# EAGLE design TuringMixExpanderNoLogo (EAGLE 7.2.0)
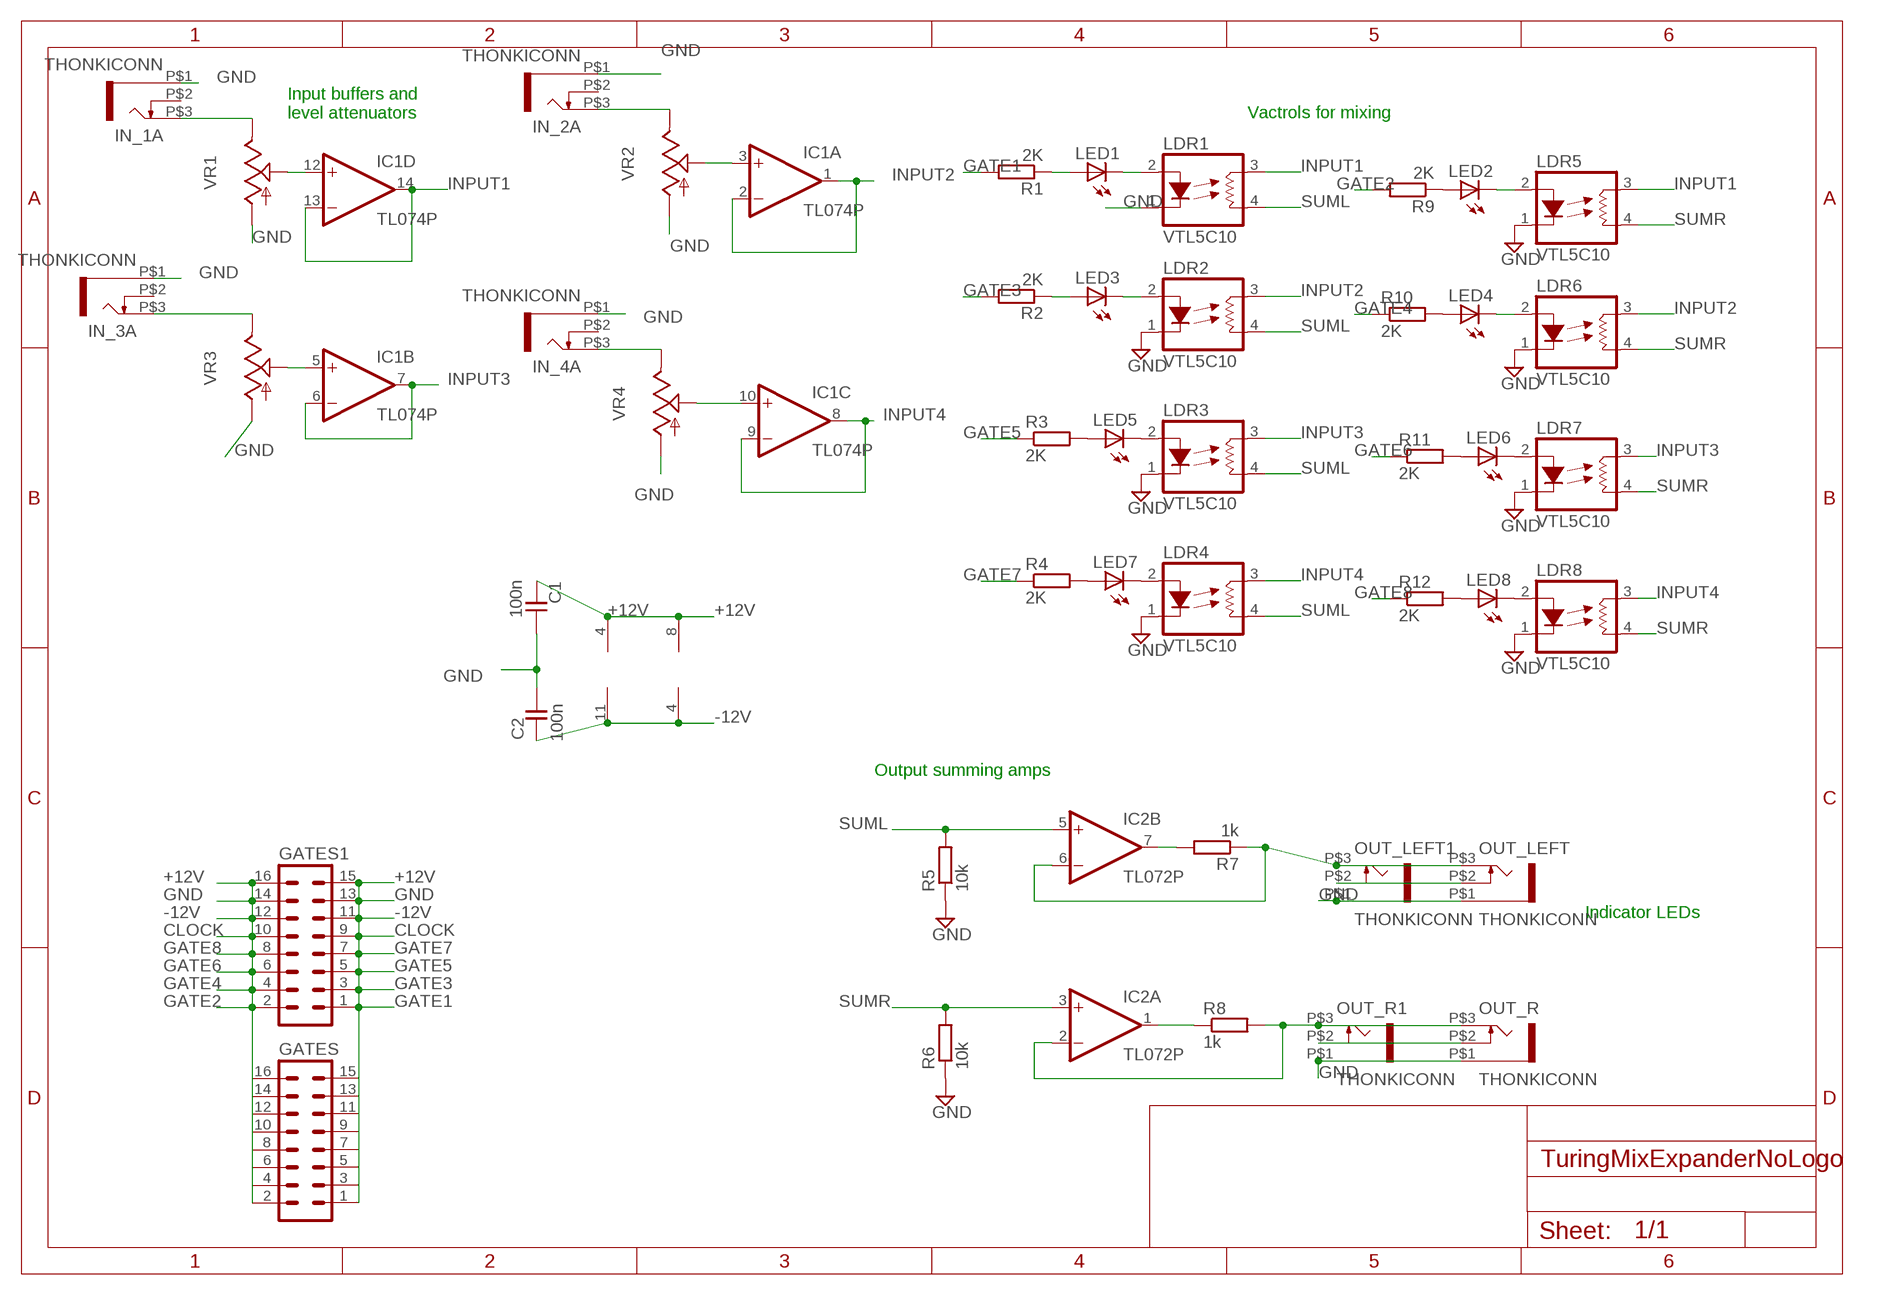
[diagram p0: schematic, sheet 1]

## Parts
C1  100n  C-EU050-024X044  [C050-024X044]
C2  100n  C-EU050-024X044  [C050-024X044]
GATES  MA08-2  [MA08-2]
GATES1  MA08-2  [MA08-2]
IC1  TL074P  [DIL14]
IC2  TL072P  [DIL08]
IN_1A  THONKICONN  [THONKICONN]
IN_2A  THONKICONN  [THONKICONN]
IN_3A  THONKICONN  [THONKICONN]
IN_4A  THONKICONN  [THONKICONN]
LDR1  VTL5C10  [VTL5C]
LDR2  VTL5C10  [VTL5C]
LDR3  VTL5C10  [VTL5C]
LDR4  VTL5C10  [VTL5C]
LDR5  VTL5C10  [VTL5C]
LDR6  VTL5C10  [VTL5C]
LDR7  VTL5C10  [VTL5C]
LDR8  VTL5C10  [VTL5C]
LED1  LED3MM  [LED3MM]
LED2  LED3MM  [LED3MM]
LED3  LED3MM  [LED3MM]
LED4  LED3MM  [LED3MM]
LED5  LED3MM  [LED3MM]
LED6  LED3MM  [LED3MM]
LED7  LED3MM  [LED3MM]
LED8  LED3MM  [LED3MM]
OUT_LEFT  THONKICONN  [THONKICONN]
OUT_LEFT1  THONKICONN  [THONKICONN]
OUT_R  THONKICONN  [THONKICONN]
OUT_R1  THONKICONN  [THONKICONN]
R1  2K  R-EU_0207/7  [0207/7]
R2  2K  R-EU_0207/7  [0207/7]
R3  2K  R-EU_0207/7  [0207/7]
R4  2K  R-EU_0207/7  [0207/7]
R5  10k  R-EU_0207/7  [0207/7]
R6  10k  R-EU_0207/7  [0207/7]
R7  1k  R-EU_0207/7  [0207/7]
R8  1k  R-EU_0207/7  [0207/7]
R9  2K  R-EU_0207/7  [0207/7]
R10  2K  R-EU_0207/7  [0207/7]
R11  2K  R-EU_0207/7  [0207/7]
R12  2K  R-EU_0207/7  [0207/7]
VR1  ALPHA-9MMF2A  [EVUF]
VR2  ALPHA-9MMF2A  [EVUF]
VR3  ALPHA-9MMF2A  [EVUF]
VR4  ALPHA-9MMF2A  [EVUF]

## Nets
+12V [power]: C1.2 GATES1.15 GATES1.16 GATES.15 GATES.16 IC1.4(P:V+) IC2.8(P:V+)
-12V [power]: C2.2 GATES1.11 GATES1.12 GATES.11 GATES.12 IC1.11(P:V-) IC2.4(P:V-)
CLOCK: GATES1.9 GATES1.10 GATES.9 GATES.10
GATE1: GATES1.1 GATES.1 R1.2
GATE2: GATES1.2 GATES.2 R9.2
GATE3: GATES1.3 GATES.3 R2.2
GATE4: GATES1.4 GATES.4 R10.1
GATE5: GATES1.5 GATES.5 R3.1
GATE6: GATES1.6 GATES.6 R11.1
GATE7: GATES1.7 GATES.7 R4.1
GATE8: GATES1.8 GATES.8 R12.1
GND [ground]: C1.1 C2.1 GATES1.13 GATES1.14 GATES.13 GATES.14 IN_1A.P$1 IN_2A.P$1 IN_3A.P$1 IN_4A.P$1 LDR1.1(LED-) LDR2.1(LED-) LDR3.1(LED-) LDR4.1(LED-) LDR5.1(LED-) LDR6.1(LED-) LDR7.1(LED-) LDR8.1(LED-) OUT_LEFT1.P$1 OUT_LEFT.P$1 OUT_R1.P$1 OUT_R.P$1 R5.1 R6.1 VR1.1(A) VR2.1(A) VR3.1(A) VR4.1(A)
INPUT1: IC1.13(D:-IN) IC1.14(D:OUT) LDR1.3(RES1) LDR5.3(RES1)
INPUT2: IC1.1(A:OUT) IC1.2(A:-IN) LDR2.3(RES1) LDR6.3(RES1)
INPUT3: IC1.6(B:-IN) IC1.7(B:OUT) LDR3.3(RES1) LDR7.3(RES1)
INPUT4: IC1.8(C:OUT) IC1.9(C:-IN) LDR4.3(RES1) LDR8.3(RES1)
N$1: IN_1A.P$3 VR1.3(E)
N$2: IC1.12(D:+IN) VR1.2(S)
N$3: IN_2A.P$3 VR2.3(E)
N$4: IC1.3(A:+IN) VR2.2(S)
N$5: IC2.7(B:OUT) R7.2
N$6: IC2.1(A:OUT) R8.1
N$7: IC2.6(B:-IN) OUT_LEFT1.P$3 OUT_LEFT.P$3 R7.1
N$10: IC2.2(A:-IN) OUT_R1.P$3 OUT_R.P$3 R8.2
N$11: IC1.5(B:+IN) VR3.2(S)
N$12: IN_3A.P$3 VR3.3(E)
N$13: IN_4A.P$3 VR4.3(E)
N$14: LDR1.2(LED+) LED1.K(C)
N$15: LDR2.2(LED+) LED3.K(C)
N$16: LDR3.2(LED+) LED5.K(C)
N$17: LDR4.2(LED+) LED7.K(C)
N$18: LDR5.2(LED+) LED2.K(C)
N$19: LDR6.2(LED+) LED4.K(C)
N$20: LDR7.2(LED+) LED6.K(C)
N$21: LDR8.2(LED+) LED8.K(C)
N$22: OUT_LEFT1.P$2 OUT_LEFT.P$2
N$23: IC1.10(C:+IN) VR4.2(S)
N$24: OUT_R1.P$2 OUT_R.P$2
N$25: LED1.A R1.1
N$26: LED3.A R2.1
N$27: LED5.A R3.2
N$28: LED7.A R4.2
N$29: LED2.A R9.1
N$30: LED4.A R10.2
N$31: LED6.A R11.2
N$32: LED8.A R12.2
SUML: IC2.5(B:+IN) LDR1.4(RES2) LDR2.4(RES2) LDR3.4(RES2) LDR4.4(RES2) R5.2
SUMR: IC2.3(A:+IN) LDR5.4(RES2) LDR6.4(RES2) LDR7.4(RES2) LDR8.4(RES2) R6.2
Unconnected: IN_1A.P$2 IN_2A.P$2 IN_3A.P$2 IN_4A.P$2

## Notes on the sheet
- Input buffers and 
  level attenuators
- Vactrols for mixing
- Output summing amps
- Indicator LEDs

## Library data of the parts
C1 C2 = TomW:C-EU: CAPACITOR, European symbol
GATES GATES1 = con-lstb:MA08-2: PIN HEADER; OC_FARNELL: unknown; OC_NEWARK: unknown
IC1 = linear:TL074: OP AMP
IC2 = TomW:TL072: OP AMP
IN_1A IN_2A IN_3A IN_4A OUT_LEFT OUT_LEFT1 OUT_R OUT_R1 = TomW:THONKICONN
LDR1-LDR8 = TomW:VTL5C*: Low Cost Axial Vactrols Source: www.perkinelmer.com/opto ... vtl5c9_c10.pdf
LED1-LED8 = TomW:LED: LED OSRAM: - CHIPLED LG R971, LG N971, LY N971, LG Q971, LY Q971, LO R971, LY R971 LH N974, LH R974 LS Q976, LO Q976, LY Q976 LO Q996 - Hyper CHIPLED LW Q18S LB Q993, LB Q99A, LB R99A - SideLED LS A670, LO A670, LY A670, LG A670, LP A670 LB A673, LV A673, LT A673, LW A673 LH A674 LY A675 LS A676, LA A676, LO A676, LY A676, LW A676 LS A679, LY A679, LG A679 - Hyper Micro SIDELED® LS Y876, LA Y876, LO Y876, LY Y876 LT Y87S - SmartLED LW L88C, LW L88S LB L89C, LB L89S, LG L890 LS L89K, LO L89K, LY L89K LS L896, LA L896, LO L896, LY L896 - TOPLED LS T670, LO T670, LY T670, LG T670, LP T670 LSG T670, LSP T670, LSY T670, LOP T670, LYG T670 LG T671, LOG T671, LSG T671 LB T673, LV T673, LT T673, LW T673 LH T674 LS T676, LA T676, LO T676, LY T676, LB T676, LH T676, LSB T676, LW T676 LB T67C, LV T67C, LT T67C, LS T67K, LO T67K, LY T67K, LW E67C LS E67B, LA E67B, LO E67B, LY E67B, LB E67C, LV E67C, LT E67C LW T67C LS T679, LY T679, LG T679 LS T770, LO T770, LY T770, LG T770, LP T770 LB T773, LV T773, LT T773, LW T773 LH T774 LS E675, LA E675, LY E675, LS T675 LS T776, LA T776, LO T776, LY T776, LB T776 LHGB T686 LT T68C, LB T68C - Hyper Mini TOPLED® LB M676 - Mini TOPLED Santana® LG M470 LS M47K, LO M47K, LY M47K Source: http://www.osram.convergy.de LUXEON: - LUMILED® LXK2-PW12-R00, LXK2-PW12-S00, LXK2-PW14-U00, LXK2-PW14-V00 LXK2-PM12-R00, LXK2-PM12-S00, LXK2-PM14-U00 LXK2-PE12-Q00, LXK2-PE12-R00, LXK2-PE12-S00, LXK2-PE14-T00, LXK2-PE14-U00 LXK2-PB12-K00, LXK2-PB12-L00, LXK2-PB12-M00, LXK2-PB14-N00, LXK2-PB14-P00, LXK2-PB14-Q00 LXK2-PR12-L00, LXK2-PR12-M00, LXK2-PR14-Q00, LXK2-PR14-R00 LXK2-PD12-Q00, LXK2-PD12-R00, LXK2-PD12-S00 LXK2-PH12-R00, LXK2-PH12-S00 LXK2-PL12-P00, LXK2-PL12-Q00, LXK2-PL12-R00 Source: www.luxeon.com KINGBRIGHT: KA-3528ASYC Source: www.kingbright.com
R1-R12 = TomW:R-EU_: RESISTOR, European symbol
VR1-VR4 = TomW:ALPHA-9MM: 9 mm Square Rotary Potentiometers Source: Panasonic

## Net classes
0 default: width 0.254 mm
1 power: width 0.406 mm
2 ground: width 0.406 mm

## Board
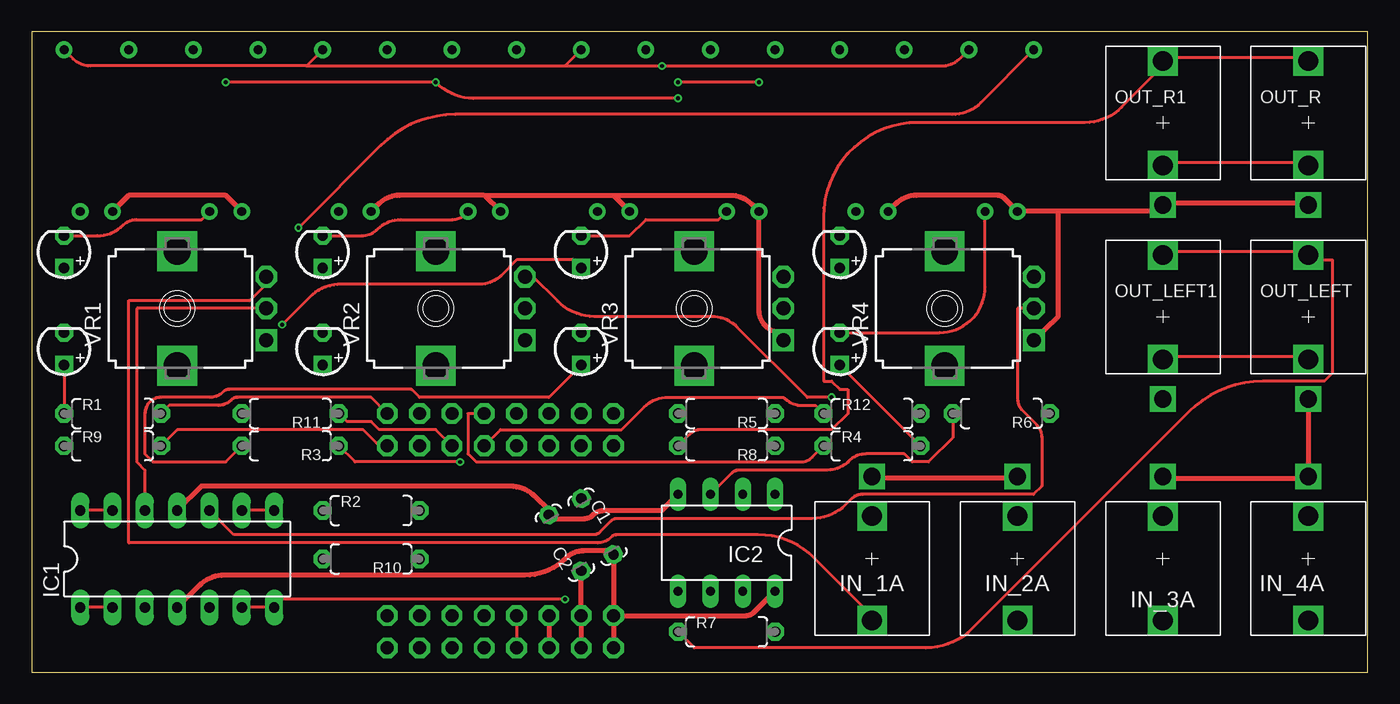
[diagram p1: board, top side]
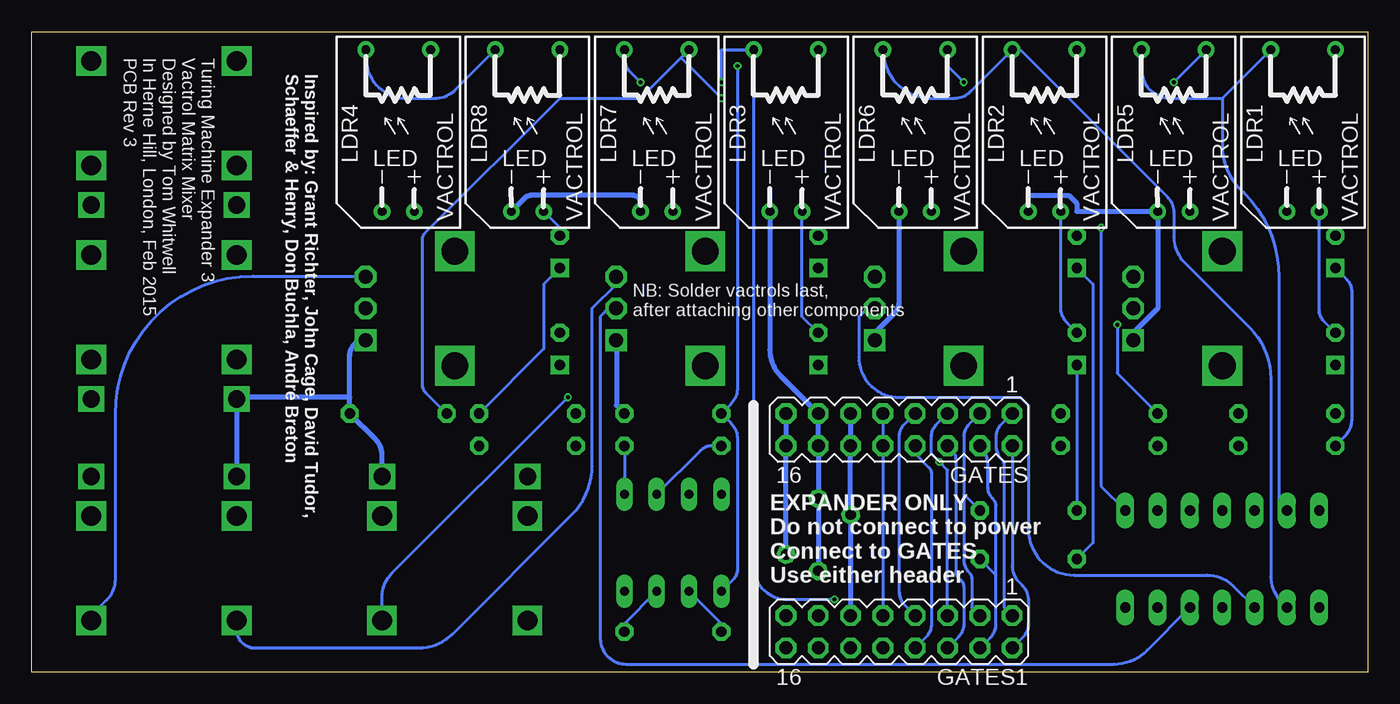
[diagram p2: board, bottom side, seen from below]

Size 105 x 50.31 mm. Coordinates in mm from the lower left corner, seen from the top.
Outline: 0,50.31 0,0 105,0 105,50.31 0,50.31
Copper layers (1*2*15*16): Top 0.035mm / dielectric 0.2mm / Route2 0.0175mm / dielectric 1.1mm / Route15 0.0175mm / dielectric 0.2mm / Bottom 0.035mm
Design rules "MT Design Rules": minimum track width 6mil, minimum drill 12mil, track to track 10mil, track to pad 10mil, pad to pad 6mil, via to via 6mil, smd to smd 0mil, copper to edge 10mil, drill to drill 10mil, minimum pad ring 12mil, minimum via ring 6mil, stop-mask expansion 2mil, vias tented up to drill 25mil, thermal gap 10mil

### Footprints (pad centres in the part's own frame; a part is rotated, then mirrored left to right if it is on the bottom)
C050-024X044 = drill 0.813 octagon: 1 -2.54,0; 2 2.54,0
MA08-2 = drill 1.016 octagon: 1 -8.89,-1.27; 2 -8.89,1.27; 3 -6.35,-1.27; 4 -6.35,1.27; 5 -3.81,-1.27; 6 -3.81,1.27; 7 -1.27,-1.27; 8 -1.27,1.27; 9 1.27,-1.27; 10 1.27,1.27; 11 3.81,-1.27; 12 3.81,1.27; 13 6.35,-1.27; 14 6.35,1.27; 15 8.89,-1.27; 16 8.89,1.27
DIL14 = drill 0.813 long: 1 -7.62,-3.81; 2 -5.08,-3.81; 3 -2.54,-3.81; 4 0,-3.81; 5 2.54,-3.81; 6 5.08,-3.81; 7 7.62,-3.81; 8 7.62,3.81; 9 5.08,3.81; 10 2.54,3.81; 11 0,3.81; 12 -2.54,3.81; 13 -5.08,3.81; 14 -7.62,3.81
DIL08 = drill 0.7 long: 1 -3.81,-3.81; 2 -1.27,-3.81; 3 1.27,-3.81; 4 3.81,-3.81; 5 3.81,3.81; 6 1.27,3.81; 7 -1.27,3.81; 8 -3.81,3.81
THONKICONN = drill 1.35 square: P$1 0,-6.48 | drill 1.55 square: P$2 0,-3.38; P$3 0,4.84
VTL5C = drill 0.7 pad 1.3: 1 -6.35,1.27; 2 -6.35,-1.27; 3 6.35,2.54; 4 6.35,-2.54
LED3MM = drill 0.813 square: A -1.27,0 | drill 0.813 octagon: K 1.27,0
0207/7 = drill 0.813 octagon: 1 -3.81,0; 2 3.81,0
EVUF = drill 1.1 pad 1.676 square: 1 -2.5,-7 | drill 1.1 pad 1.676 octagon: 2 0,-7; 3 2.5,-7 | drill 2.1 pad 2.8 square: M1 4.5,0; M2 -4.5,0

### Placement (x,y rotation side)
C1  44.45,11.43 300 top
C2  41.91,10.16 120 top
GATES  36.83,19.05 180 bottom
GATES1  36.83,3.17 180 bottom
IC1  11.43,8.89 0 top
IC2  54.61,10.16 180 top
IN_1A  66.04,8.89 180 top
IN_2A  77.47,8.89 180 top
IN_3A  88.9,8.89 180 top
IN_4A  100.33,8.89 180 top
LDR1  5.08,42.55 90 bottom
LDR2  25.4,42.55 90 bottom
LDR3  45.72,42.55 90 bottom
LDR4  76.2,42.55 90 bottom
LDR5  15.24,42.55 90 bottom
LDR6  35.56,42.55 90 bottom
LDR7  55.88,42.55 90 bottom
LDR8  66.04,42.55 90 bottom
LED1  2.54,25.4 90 top
LED2  2.54,33.02 90 top
LED3  22.86,25.4 90 top
LED4  22.86,33.02 90 top
LED5  43.18,25.4 90 top
LED6  43.18,33.02 90 top
LED7  63.5,25.4 90 top
LED8  63.5,33.02 90 top
OUT_LEFT  100.33,27.94 0 top
OUT_LEFT1  88.9,27.94 0 top
OUT_R  100.33,43.18 0 top
OUT_R1  88.9,43.18 0 top
R1  6.35,20.32 0 top
R2  26.67,12.7 0 top
R3  20.32,17.78 180 top
R4  66.04,17.78 0 top
R5  54.61,20.32 180 top
R6  76.2,20.32 180 top
R7  54.61,3.17 0 top
R8  54.61,17.78 180 top
R9  6.35,17.78 0 top
R10  26.67,8.89 180 top
R11  20.32,20.32 180 top
R12  66.04,20.32 0 top
VR1  11.43,28.57 90 top
VR2  31.75,28.57 90 top
VR3  52.07,28.57 90 top
VR4  71.75,28.57 90 top

### Tracks (layer width: path | path; a pad name or v marks a point on that pad's centre or on a via)
+12V
  Top 0.406: GATES1.15 56.14,4.45 arc45 56.78,4.71 IC2.8 | GATES1.15 GATES1.16 | IC1.4 13.14,6.79 arc-45 15.15,7.62 38.74,7.62 arc45 41.98,8.96 arc-45 43.34,9.53 45.72,9.53 C1.2 GATES1.15
  Bottom 0.406: GATES.15 GATES.16 C1.2
-12V
  Top 0.406: GATES1.11 GATES1.12 | IC2.4 49.53,12.7 44.98,12.7 arc45 44.08,12.33 arc-45 43.44,12.06 40.64,12.06 C2.2 40.64,12.7 39.52,13.82 arc45 37.62,14.61 13.34,14.61 IC1.11
  Bottom 0.406: GATES.11 GATES.12 C2.2 GATES1.11
CLOCK
  Top 0.254: GATES1.9 GATES1.10
  Bottom 0.254: GATES.9 GATES.10 GATES1.9
GATE1
  Top 0.254: R1.2 10.79,20.95 14.65,20.95 arc45 15.66,21.37 arc-45 16.18,21.59 26.67,21.59 GATES.1
  Bottom 0.254: GATES1.1 28.57,5.08 28.57,16.25 arc-45 28.76,16.7 28.79,16.73 arc45 29.21,17.73 29.21,18.52 arc45 28.84,19.42 GATES.1
GATE2
  Top 0.254: R9.2 11.43,19.05 26.04,19.05 27.3,17.78 GATES.2
  Bottom 0.254: GATES1.2 27.09,2.76 arc-45 26.67,3.76 26.67,5.61 arc-45 27.2,6.88 27.41,7.09 arc45 27.94,8.36 GATES.2
GATE3
  Bottom 0.254: 31.75,13.97 R2.2 | GATES.3 31.38,19.42 arc-45 31.75,18.52 31.75,13.97 | GATES1.3 31.11,5.08 31.11,7.36 arc-45 31.3,7.81 31.33,7.84 arc45 31.75,8.84 31.75,13.97
GATE4
  Bottom 0.254: 29.21,7.62 R10.1 | GATES1.4 29.63,2.76 arc-45 29.21,3.76 29.21,7.62 | 29.21,7.62 29.21,13.07 arc-45 29.4,13.52 29.43,13.55 arc45 29.84,14.56 29.84,16.31 arc-45 30.43,17.73 GATES.4
GATE5  (via drill 0.3)
  Top 0.254: R3.1 25.4,16.51 v33.66,16.51
  Bottom 0.254: GATES1.5 33.02,15.88 v33.66,16.51 34.29,17.14 34.29,18.52 arc45 33.92,19.42 GATES.5
GATE6
  Top 0.254: R11.1 24.77,19.68 26.67,19.68 27.3,19.05 31.75,19.05 GATES.6
  Bottom 0.254: GATES1.6 32.17,2.76 arc-45 31.75,3.76 31.75,6.72 arc-45 31.94,7.17 32.2,7.43 arc45 32.38,7.88 32.38,16.77 arc-45 32.65,17.41 GATES.6
GATE7
  Top 0.254: R4.1 61.33,16.88 arc-45 60.43,16.51 34.92,16.51 34.29,17.14 34.29,20.32 GATES.7
  Bottom 0.254: GATES.7 36.46,19.42 arc-45 36.83,18.52 36.83,6.3 arc-45 36.41,5.3 GATES1.7
GATE8
  Top 0.254: R12.1 61.59,20.95 60.59,20.95 arc-45 59.05,21.59 49.98,21.59 arc45 48.13,20.82 46.35,19.05 36.83,19.05 GATES.8
  Bottom 0.254: GATES1.8 34.71,2.76 arc-45 34.29,3.76 34.29,15.61 arc-45 34.48,16.06 35.56,17.14 GATES.8
GND
  Top 0.406: LDR8.1 67.91,36.79 arc-45 69.53,37.47 75.94,37.47 arc-45 76.39,37.28 LDR4.1 80.64,36.2 | OUT_R.P$1 100.33,36.83 88.9,36.83 OUT_R1.P$1 88.9,36.2 80.64,36.2 | OUT_LEFT.P$1 IN_4A.P$1 100.33,15.24 88.9,15.24 IN_3A.P$1 | IN_1A.P$1 66.04,15.24 77.47,15.24 IN_2A.P$1 | 80.64,36.2 80.64,27.89 VR4.1 | LDR1.1 7.62,37.47 15.24,37.47 LDR5.1 | C2.1 GATES1.13 GATES1.14 | VR3.1 59.05,26.67 58.95,26.67 arc-90 57.15,28.47 LDR7.1 56.55,36.79 arc45 54.93,37.47 45.72,37.47 | 35.56,37.47 28.89,37.47 arc45 27.27,36.79 LDR2.1 | LDR6.1 35.56,37.47 | 45.72,37.47 LDR3.1 | 35.56,37.47 45.72,37.47
  Bottom 0.406: IN_3A.P$1 OUT_LEFT1.P$1 88.9,21.59 80.01,21.59 | IN_2A.P$1 77.47,17.04 arc-45 78,18.31 R6.1 80.01,21.59 | 80.01,21.59 80.01,24.87 arc45 79.64,25.77 79.38,26.04 VR4.1 | VR1.1 18.41,26.67 16.51,28.57 LDR5.1 22.86,36.2 22.86,36.83 23.5,37.47 26.67,37.47 LDR2.1 | C2.1 C1.1 GATES.14 GATES.13 46.16,23.3 arc45 46.99,25.31 LDR3.1 | R5.1 59.05,20.95 59.05,26.04 VR3.1 | LDR6.1 36.83,29.16 arc45 37.25,28.16 38.73,26.67 VR2.1 | LDR7.1 57.15,36.83 arc-90 57.78,37.47 65.78,37.47 arc-45 66.23,37.28 LDR8.1
INPUT1
  Top 0.254: IC1.13 IC1.14
  Bottom 0.254: 11.43,45.09 LDR1.3 | LDR5.3 17.78,47.38 arc-90 15.49,45.09 11.43,45.09 | IC1.13 6.99,13.34 6.99,31.04 arc-45 9.73,37.67 10.09,38.03 arc45 11.43,41.27 11.43,45.09
INPUT2
  Top 0.254: IC1.2 IC1.1
  Bottom 0.254: LDR6.3 arc-90 34.29,45.09 32.54,45.09 arc-45 31.19,45.64 LDR2.3 27.3,48.9 15.77,37.36 arc45 15.24,36.09 15.24,34.2 arc-45 14.41,32.19 9.28,27.06 arc45 7.62,23.05 7.62,7.53 arc-45 6.79,5.52 IC1.2
INPUT3  (via drill 0.3)
  Top 0.254: IC1.6 IC1.7 19.68,5.71 v41.91,5.71 | v57.15,46.35 v50.8,46.35
  Bottom 0.254: v50.8,46.35 50.8,48.9 LDR3.3 48.26,8.33 arc-90 45.64,5.71 v41.91,5.71 | LDR7.3 58.42,48.21 arc-45 58,47.21 v57.15,46.35
INPUT4  (via drill 0.3)
  Top 0.254: IC1.8 IC1.9 | LDR4.3 74.59,44.74 arc-45 72.34,43.81 33.27,43.81 arc45 27.42,41.39 v20.95,34.92
  Bottom 0.254: LDR4.3 78.74,48.26 arc-90 75.56,45.09 73.34,45.09 arc-45 71.72,45.76 LDR8.3 | IC1.8 20.95,14.61 v20.95,34.92
N$1
  Top 0.254: VR1.3 18.41,30.48 17.14,29.21 7.62,29.21 7.62,10.16 44.5,10.16 arc45 45.5,10.58 45.53,10.61 arc-45 45.98,10.79 57.1,10.79 arc-45 61.52,8.96 66.04,4.45 IN_1A.P$3
N$2
  Top 0.254: IC1.12 8.89,15.88 8.26,16.51 8.26,28.57 VR1.2
N$3  (via drill 0.3)
  Top 0.254: v62.87,21.59 60.96,21.59 55.44,27.11 arc45 53.43,27.94 44.23,27.94 arc-45 41.35,29.13 39.37,31.11 VR2.3
  Bottom 0.254: IN_2A.P$3 77.47,5.9 arc45 76.7,7.75 v62.87,21.59
N$4
  Bottom 0.254: IC1.3 10.6,6.79 arc-45 12.61,7.62 23.08,7.62 arc90 26.67,11.21 26.67,20.95 27.3,21.59 36.83,21.59 arc90 40.01,24.77 40.01,27.94 39.37,28.57 VR2.2
N$5
  Bottom 0.254: IC2.7 58.42,3.81 R7.2
N$6
  Bottom 0.254: R8.1 IC2.1
N$7
  Top 0.254: R7.1 52.07,1.91 70.27,1.91 arc45 73.89,3.4 90.93,20.44 arc-45 96.76,22.86 101.6,22.86 102.23,23.5 102.23,32.38 100.33,32.38 OUT_LEFT.P$3 100.33,33.02 88.9,33.02 OUT_LEFT1.P$3
  Bottom 0.254: IC2.6 50.8,3.81 R7.1
N$10
  Top 0.254: OUT_R.P$3 100.33,48.26 88.9,48.26 OUT_R1.P$3 88.9,47.62 85.65,44.37 arc-45 82.77,43.18 69.64,43.18 arc90 62.23,35.77 62.23,22.86 62.87,22.86 63.5,22.23 64.14,22.23 64.14,20.32 62.87,19.05 52.6,19.05 arc45 51.7,18.68 R8.2
  Bottom 0.254: R8.2 51.54,17.78 arc-45 52.44,17.41 IC2.2
N$11
  Bottom 0.254: IC1.5 17.33,1.72 arc45 19.95,0.64 58.32,0.64 arc90 60.33,2.64 60.33,27.94 59.69,28.57 VR3.2
N$12
  Bottom 0.254: IN_3A.P$3 88.9,3.33 arc-90 87.48,1.91 74.56,1.91 arc-45 71.94,2.99 62.54,12.39 arc-45 60.96,16.2 60.96,28.57 59.05,30.48 VR3.3
N$13
  Bottom 0.254: VR4.3 79.38,31.11 87.61,31.11 arc-90 98.42,20.3 98.42,7.3 arc45 99.1,5.68 100.33,4.45 IN_4A.P$3
N$14
  Bottom 0.254: LED1.K 3.44,27.57 arc45 3.81,28.47 LDR1.2
N$15
  Bottom 0.254: LED3.K 23.6,27.41 arc45 24.13,28.68 LDR2.2
N$16
  Bottom 0.254: LDR3.2 44.45,27.94 LED5.K
N$17
  Top 0.254: LED7.K 71.34,26.67 arc90 74.93,30.26 LDR4.2
N$18
  Top 0.254: LDR5.2 13.34,35.56 8.24,35.56 arc45 7.18,35.12 arc-45 5.17,34.29 LED2.K
N$19
  Top 0.254: LDR6.2 34.07,35.98 arc-45 33.07,35.56 28.99,35.56 arc45 27.2,34.82 arc-45 25.93,34.29 LED4.K
N$20
  Top 0.254: LDR7.2 53.98,35.56 48.26,35.56 46.99,34.29 LED6.K
N$21
  Bottom 0.254: LDR8.2 63.5,34.92 LED8.K
N$22
  Top 0.254: OUT_LEFT1.P$2 88.9,24.77 100.33,24.77 OUT_LEFT.P$2
N$23
  Top 0.254: IC1.10 15.88,10.79 44.19,10.79 arc45 44.64,10.98 45.53,11.88 arc-45 45.98,12.06 61.33,12.06 arc45 63.95,13.15 64.4,13.6 arc-45 65.3,13.97 78.74,13.97 79.38,14.61 79.38,18.46 arc45 78.96,19.47 77.89,20.54 arc-45 77.47,21.54 77.47,28.57 VR4.2
N$24
  Top 0.254: OUT_R1.P$2 88.9,40.01 100.33,40.01 OUT_R.P$2
N$25
  Top 0.254: LED1.A R1.1
N$26
  Bottom 0.254: LED3.A R2.1
N$27
  Top 0.254: R3.2 15.24,16.51 9.53,16.51 8.89,17.14 8.89,20.32 arc-90 10.16,21.59 14.02,21.59 arc45 15.02,22.01 arc-45 15.55,22.23 29.84,22.23 30.48,21.59 40.64,21.59 LED5.A
N$28
  Top 0.254: LED7.A R4.2
N$29
  Bottom 0.254: R9.1 1.8,18.52 arc-45 1.27,19.79 1.27,29.95 arc-45 1.64,30.85 LED2.A
N$30
  Bottom 0.254: R10.2 21.59,10.16 21.59,30.48 LED4.A
N$31  (via drill 0.3)
  Top 0.254: v19.68,27.3 21.81,29.43 arc-45 24.35,30.48 35.25,30.48 arc45 36.87,31.15 38.1,32.38 42.55,32.38 LED6.A
  Bottom 0.254: R11.2 19.68,23.5 v19.68,27.3
N$32
  Bottom 0.254: R12.2 64.77,25.4 64.77,30.48 LED8.A
SUML  (via drill 0.3)
  Top 0.254: 21.59,47.62 4.6,47.62 arc-45 3.25,48.18 LDR1.4 | LDR2.4 21.59,47.62 | 41.91,47.62 LDR3.4 | 21.59,47.62 41.91,47.62 | LDR4.4 73.06,48.3 arc-45 71.44,47.62 v49.53,47.62 41.91,47.62
  Bottom 0.254: IC2.5 49.9,7.25 arc-45 49.53,8.15 49.53,18.31 arc-45 50.06,19.58 R5.2 50.06,21.06 arc-45 49.53,22.33 v49.53,47.62
SUMR  (via drill 0.3)
  Top 0.254: v15.24,46.35 v31.75,46.35 31.83,46.28 arc45 34.7,45.09 v50.8,45.09 | IC2.3 54.98,15.61 arc-45 55.62,15.88 62.55,15.88 arc45 64.17,16.55 64.21,16.59 arc-45 65.56,17.14 68.58,17.14 69.22,16.51 70.48,16.51 72.39,18.41 R6.2
  Bottom 0.254: v15.24,46.35 LDR5.4 | v31.75,46.35 33.02,47.62 LDR6.4 | 63.5,45.09 57.41,45.09 arc-45 56.96,45.27 53.98,48.26 | 53.98,48.26 LDR7.4 | LDR8.4 63.5,45.09 | 63.5,45.09 74.11,34.48 arc-45 74.3,34.03 74.3,22.6 arc-45 74.03,21.96 R6.2 | 53.98,48.26 v50.8,45.09

### Text on the board
bPlace: Turing Machine Expander 3 / Vactrol Matrix Mixer / Designed by Tom Whitwell / In Herne Hill, London, Feb 2015 / PCB Rev 3 | Inspired by: Grant Richter, John Cage, David Tudor, / Schaeffer & Henry, Don Buchla, André Breton | NB: Solder vactrols last, / after attaching other components | EXPANDER ONLY / Do not connect to power / Connect to GATES / Use either header